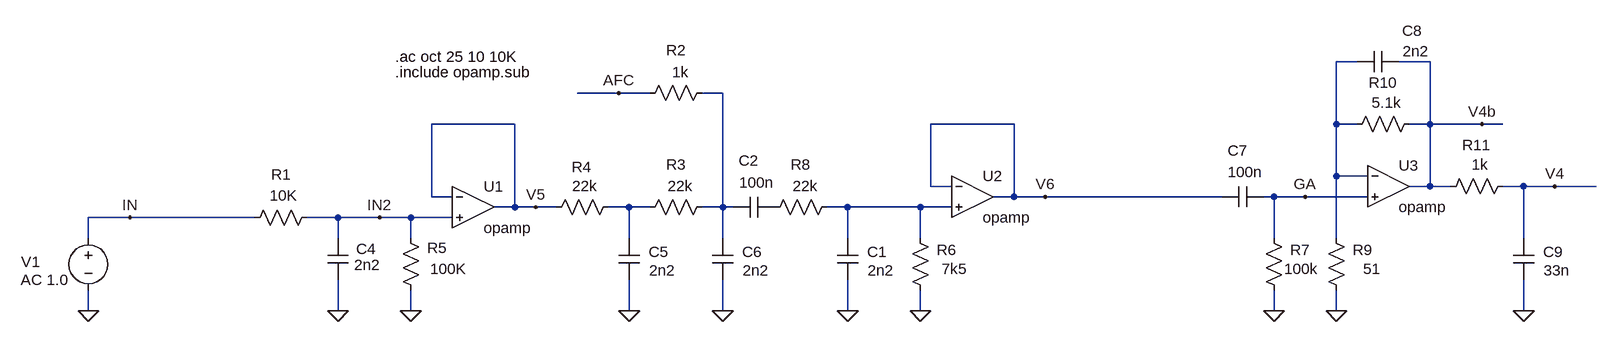
[diagram p0: schematic opamp_1k.asc]
opamp_1k.asc, the LTspice schematic file:
Version 4.1
SHEET 1 5945676 13421556
WIRE 2848 -144 2816 -144
WIRE 2960 -144 2912 -144
WIRE 1712 -96 1648 -96
WIRE 1760 -96 1712 -96
WIRE 1872 -96 1840 -96
WIRE 1552 -48 1424 -48
WIRE 2320 -48 2192 -48
WIRE 2816 -48 2816 -144
WIRE 2848 -48 2816 -48
WIRE 2960 -48 2960 -144
WIRE 2960 -48 2928 -48
WIRE 3040 -48 2960 -48
WIRE 3072 -48 3040 -48
WIRE 2816 32 2816 -48
WIRE 2864 32 2816 32
WIRE 2192 48 2192 -48
WIRE 2224 48 2192 48
WIRE 2960 48 2960 -48
WIRE 2960 48 2928 48
WIRE 2992 48 2960 48
WIRE 3104 48 3072 48
WIRE 3152 48 3104 48
WIRE 3216 48 3152 48
WIRE 1424 64 1424 -48
WIRE 1456 64 1424 64
WIRE 2320 64 2320 -48
WIRE 2320 64 2288 64
WIRE 2368 64 2320 64
WIRE 2640 64 2368 64
WIRE 2720 64 2704 64
WIRE 2768 64 2720 64
WIRE 2864 64 2768 64
WIRE 1552 80 1552 -48
WIRE 1552 80 1520 80
WIRE 1584 80 1552 80
WIRE 1616 80 1584 80
WIRE 1728 80 1696 80
WIRE 1760 80 1728 80
WIRE 1872 80 1872 -96
WIRE 1872 80 1840 80
WIRE 1888 80 1872 80
WIRE 2064 80 2032 80
WIRE 2176 80 2064 80
WIRE 2224 80 2176 80
WIRE 960 96 896 96
WIRE 1152 96 960 96
WIRE 1280 96 1232 96
WIRE 1344 96 1280 96
WIRE 1392 96 1344 96
WIRE 1456 96 1392 96
WIRE 896 128 896 96
WIRE 1280 128 1280 96
WIRE 1392 128 1392 96
WIRE 1728 128 1728 80
WIRE 1872 128 1872 80
WIRE 2064 128 2064 80
WIRE 2176 128 2176 80
WIRE 2720 128 2720 64
WIRE 2816 128 2816 32
WIRE 3104 128 3104 48
WIRE 896 240 896 208
WIRE 1280 240 1280 192
WIRE 1392 240 1392 208
WIRE 1728 240 1728 192
WIRE 1872 240 1872 192
WIRE 2064 240 2064 192
WIRE 2176 240 2176 208
WIRE 2720 240 2720 208
WIRE 2816 240 2816 208
WIRE 3104 240 3104 192
FLAG 896 240 0
FLAG 2368 64 V6
FLAG 1584 80 V5
FLAG 1280 240 0
FLAG 1728 240 0
FLAG 1872 240 0
FLAG 2176 240 0
FLAG 1392 240 0
FLAG 1712 -96 AFC
FLAG 960 96 IN
FLAG 1344 96 IN2
FLAG 2720 240 0
FLAG 2768 64 GA
FLAG 2816 240 0
FLAG 3152 48 V4
FLAG 3104 240 0
FLAG 3040 -48 V4b
FLAG 2064 240 0
SYMBOL voltage 896 112 R0
WINDOW 0 -103 52 Left 2
WINDOW 3 -104 52 Left 2
WINDOW 123 -104 80 Left 2
WINDOW 39 0 0 Left 0
SYMATTR InstName V1
SYMATTR Value ""
SYMATTR Value2 AC 1.0
SYMBOL res 1248 80 R90
WINDOW 0 -35 55 VBottom 2
WINDOW 3 -34 52 VTop 2
SYMATTR InstName R1
SYMATTR Value 10K
SYMBOL res 1712 64 R90
WINDOW 0 -30 57 VBottom 2
WINDOW 3 -32 52 VTop 2
SYMATTR InstName R4
SYMATTR Value 22k
SYMBOL res 2192 224 R180
WINDOW 0 -40 78 Left 2
WINDOW 3 -56 49 Left 2
SYMATTR InstName R6
SYMATTR Value 7k5
SYMBOL OPAMPS\\OPAMP 1488 16 R0
SYMATTR InstName U1
SYMATTR SpiceLine2 GBW=3Meg
SYMBOL OPAMPS\\OPAMP 2256 0 R0
SYMATTR InstName U2
SYMATTR SpiceLine2 GBW=3Meg
SYMBOL res 1856 64 R90
WINDOW 0 -34 56 VBottom 2
WINDOW 3 -32 49 VTop 2
SYMATTR InstName R3
SYMATTR Value 22k
SYMBOL cap 1952 64 R90
WINDOW 0 -40 40 VBottom 2
WINDOW 3 -38 28 VTop 2
SYMATTR InstName C2
SYMATTR Value 100n
SYMBOL cap 1264 192 M180
WINDOW 0 44 48 Left 2
WINDOW 3 41 23 Left 2
SYMATTR InstName C4
SYMATTR Value 2n2
SYMBOL cap 1712 192 M180
WINDOW 0 46 43 Left 2
WINDOW 3 47 15 Left 2
SYMATTR InstName C5
SYMATTR Value 2n2
SYMBOL cap 1856 192 M180
WINDOW 0 46 43 Left 2
WINDOW 3 47 15 Left 2
SYMATTR InstName C6
SYMATTR Value 2n2
SYMBOL res 1408 224 R180
WINDOW 0 -40 81 Left 2
WINDOW 3 -70 49 Left 2
SYMATTR InstName R5
SYMATTR Value 100K
SYMBOL cap 2704 48 R90
WINDOW 0 -40 40 VBottom 2
WINDOW 3 -38 28 VTop 2
SYMATTR InstName C7
SYMATTR Value 100n
SYMBOL res 2736 224 R180
WINDOW 0 -40 78 Left 2
WINDOW 3 -52 49 Left 2
SYMATTR InstName R7
SYMATTR Value 100k
SYMBOL OPAMPS\\OPAMP 2896 -16 R0
SYMATTR InstName U3
SYMATTR SpiceLine2 GBW=3Meg
SYMBOL res 2832 224 R180
WINDOW 0 -40 78 Left 2
WINDOW 3 -52 49 Left 2
SYMATTR InstName R9
SYMATTR Value 51
SYMBOL res 2944 -64 R90
WINDOW 0 -32 56 VBottom 2
WINDOW 3 -33 51 VTop 2
SYMATTR InstName R10
SYMATTR Value 5.1k
SYMBOL cap 2912 -160 R90
WINDOW 0 -16 -21 VBottom 2
WINDOW 3 -16 -26 VTop 2
SYMATTR InstName C8
SYMATTR Value 2n2
SYMBOL res 3088 32 R90
WINDOW 0 -32 56 VBottom 2
WINDOW 3 -33 51 VTop 2
SYMATTR InstName R11
SYMATTR Value 1k
SYMBOL cap 3088 192 M180
WINDOW 0 46 43 Left 2
WINDOW 3 47 15 Left 2
SYMATTR InstName C9
SYMATTR Value 33n
SYMBOL res 1856 -112 R90
WINDOW 0 -34 56 VBottom 2
WINDOW 3 -32 49 VTop 2
SYMATTR InstName R2
SYMATTR Value 1k
SYMBOL res 2048 64 R90
WINDOW 0 -34 56 VBottom 2
WINDOW 3 -32 49 VTop 2
SYMATTR InstName R8
SYMATTR Value 22k
SYMBOL cap 2048 192 M180
WINDOW 0 46 43 Left 2
WINDOW 3 47 15 Left 2
SYMATTR InstName C1
SYMATTR Value 2n2
TEXT 1368 -152 Left 2 !.ac oct 25 10 10K
TEXT 1368 -128 Left 2 !.include opamp.sub

The netlist it stands for:
* opamp_1k.asc
V1 IN 0 AC 1.0
R1 IN2 IN 10K
R4 N003 V5 22k
R6 0 N004 7k5
X§U1 V5 IN2 V5 opamp Aol=100K GBW=3Meg  ; pins invin noninvin out
X§U2 V6 N004 V6 opamp Aol=100K GBW=3Meg  ; pins invin noninvin out
R3 N002 N003 22k
C2 P001 N002 100n
C4 0 IN2 2n2
C5 0 N003 2n2
C6 0 N002 2n2
R5 0 IN2 100K
C7 GA V6 100n
R7 0 GA 100k
X§U3 N001 GA V4b opamp Aol=100K GBW=3Meg  ; pins invin noninvin out
R9 0 N001 51
R10 V4b N001 5.1k
C8 V4b N001 2n2
R11 V4 V4b 1k
C9 0 V4 33n
R2 N002 AFC 1k
R8 N004 P001 22k
C1 0 N004 2n2
.ac oct 25 10 10K
.include opamp.sub
.backanno
.end